# EAGLE design ultrasonic_sensor (EAGLE 6.6.0)
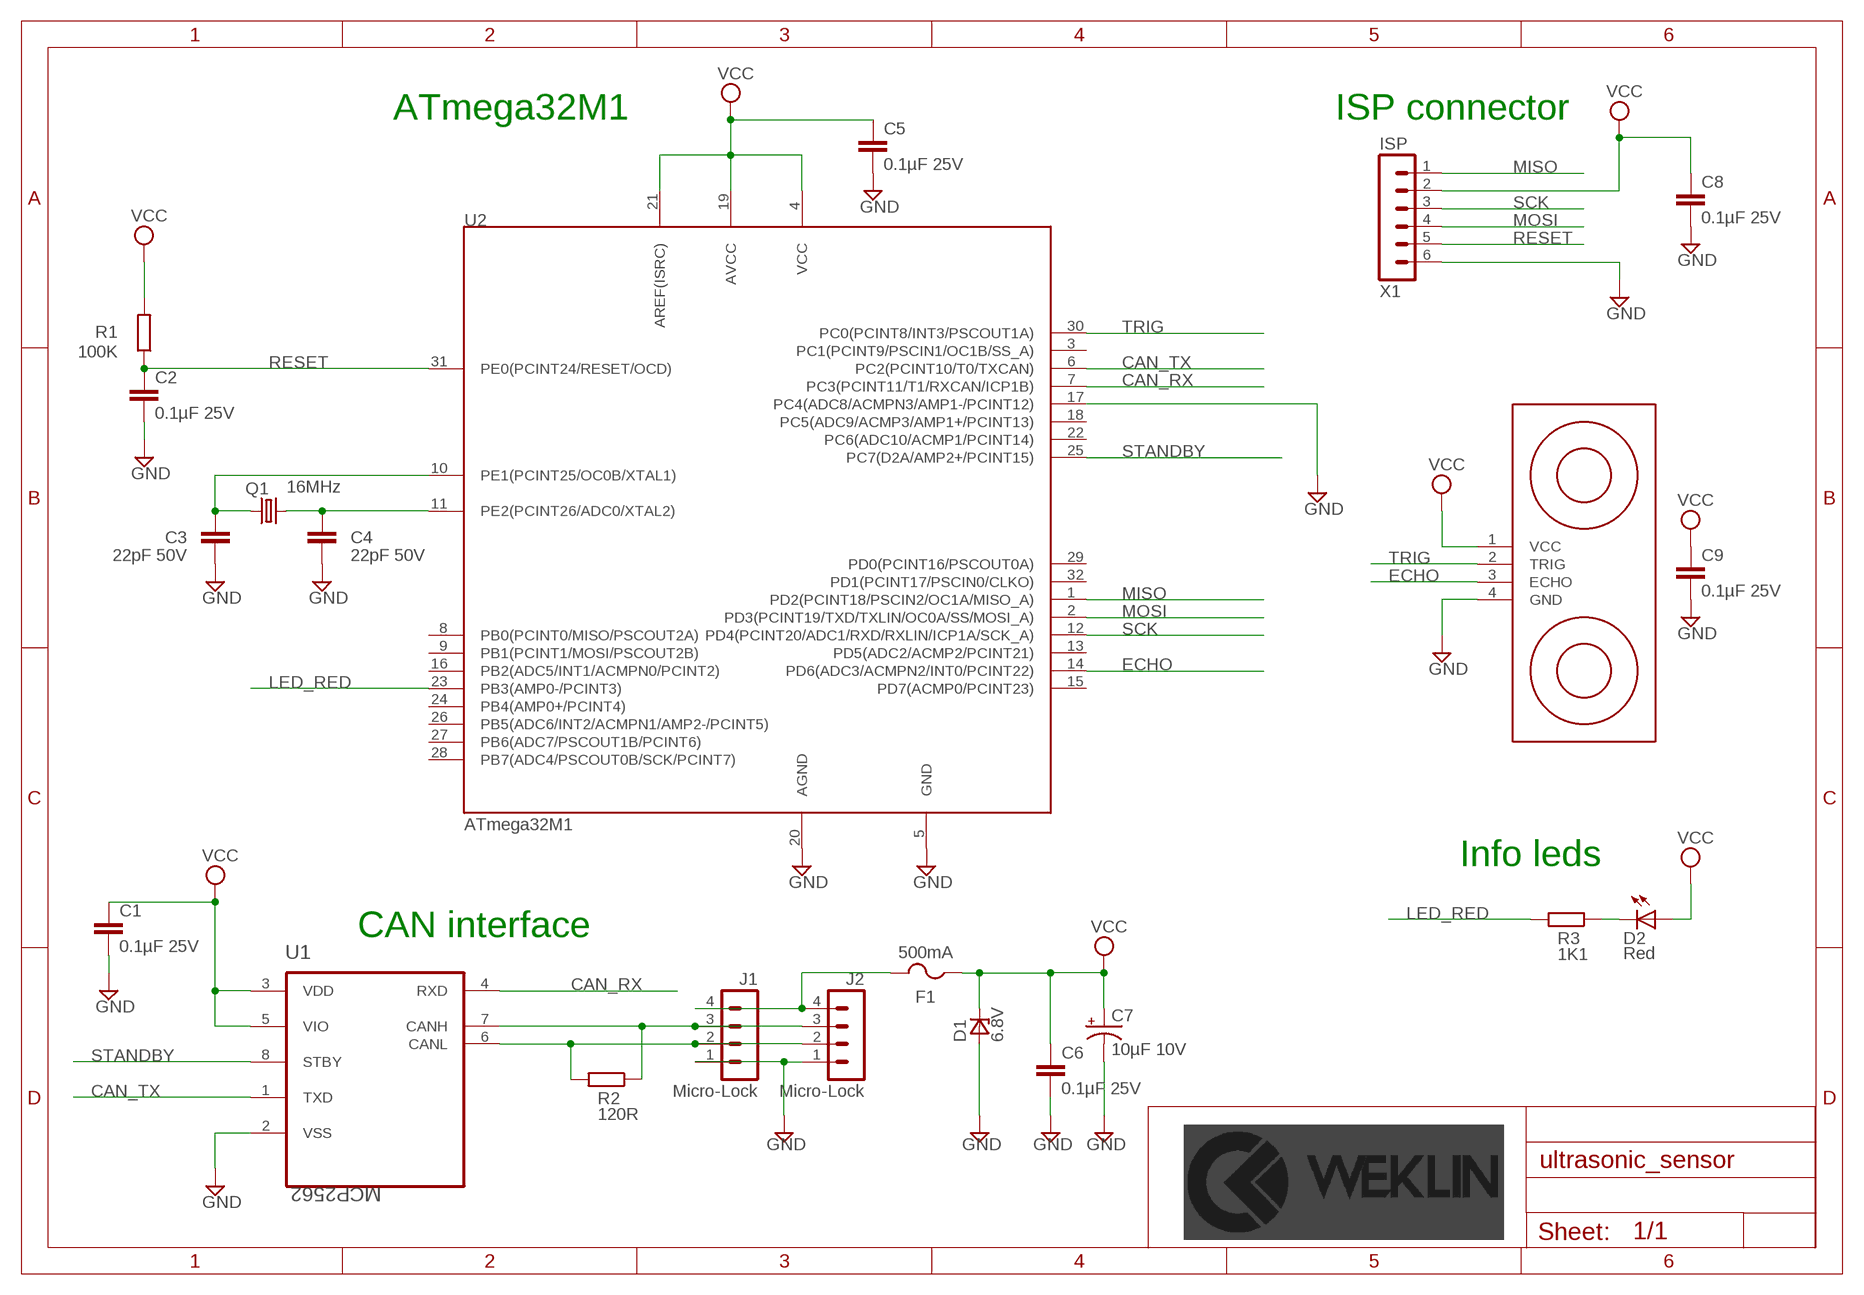
[diagram p0: schematic, sheet 1]

## Parts
C1  0.1µF 25V  CAPACITOR_NON_POL-0.1µF-25V(+-10%)(2012)  [C2012]
C2  0.1µF 25V  CAPACITOR_NON_POL-0.1µF-25V(+-10%)(2012)  [C2012]
C3  22pF 50V  CAPACITOR_NON_POL-22PF-50V(+-5%)(2012)  [C2012]
C4  22pF 50V  CAPACITOR_NON_POL-22PF-50V(+-5%)(2012)  [C2012]
C5  0.1µF 25V  CAPACITOR_NON_POL-0.1µF-25V(+-10%)(2012)  [C2012]
C6  0.1µF 25V  CAPACITOR_NON_POL-0.1µF-25V(+-10%)(2012)  [C2012]
C7  10µF 10V  CAPACITOR_POL-10µF-10V(+-10%)(3216)  [EIA3216]
C8  0.1µF 25V  CAPACITOR_NON_POL-0.1µF-25V(+-10%)(2012)  [C2012]
C9  0.1µF 25V  CAPACITOR_NON_POL-0.1µF-25V(+-10%)(2012)  [C2012]
D1  6.8V  ZENER_UNIDIR6.8  [DO-214AA]
D2  Red  LEDVLDS1235G  [VLD]
F1  500mA  FUSE  [EIARS-481-2]
J1  Micro-Lock  MICROLOCK-4CMS  [504195-0470]
J2  Micro-Lock  MICROLOCK-4CMS  [504195-0470]
Q1  16MHz  CRYSTAL-16MHZ_SMD(3225)  [SMD_KX7]
R1  100K  RESISTOR-100K(+-1%)(2012)  [R2012]
R2  120R  RESISTOR-120R(+-1%)(2012)  [R2012]
R3  1K1  RESISTOR-1K1(+-1%)(2012)  [R2012]
U1  MCP2562  MCP2562-E/SN-SOIC8  [SOIC8]
U2  ATmega32M1  ATMEGA32M1-TQFP32  [TQFP32]
U3  HC-SR04  ULTRASONIC-HC-SR04  [ULTRASONIC-HC-SR04]
X1  ISP  MINITEK_127_6WAYS-SMD  [MINITEK_127_6WAY_SMD]

## Nets
CAN_RX: U1.4(RXD) U2.7(PC3(PCINT11/T1/RXCAN/ICP1B))
CAN_TX: U1.1(TXD) U2.6(PC2(PCINT10/T0/TXCAN))
ECHO: U2.14(PD6(ADC3/ACMPN2/INT0/PCINT22)) U3.3(ECHO)
GND: C1.2 C2.2 C3.2 C4.2 C5.2 C6.2 C7.C(-) C8.2 C9.2 D1.A J1.1 J2.1 U1.2(VSS) U2.5(GND) U2.17(PC4(ADC8/ACMPN3/AMP1-/PCINT12)) U2.20(AGND) U3.4(GND) X1.6
LED_RED: R3.2 U2.23(PB3(AMP0-/PCINT3))
MISO: U2.1(PD2(PCINT18/PSCIN2/OC1A/MISO_A)) X1.1
MOSI: U2.2(PD3(PCINT19/TXD/TXLIN/OC0A/SS/MOSI_A)) X1.4
N$2: D2.C R3.1
N$4: F1.2 J1.4 J2.4
N$5: J1.2 J2.2 R2.2 U1.6(CANL)
N$6: J1.3 J2.3 R2.1 U1.7(CANH)
N$7: C4.1 Q1.3 U2.11(PE2(PCINT26/ADC0/XTAL2))
N$9: C3.1 Q1.1 U2.10(PE1(PCINT25/OC0B/XTAL1))
RESET: C2.1 R1.1 U2.31(PE0(PCINT24/RESET/OCD)) X1.5
SCK: U2.12(PD4(PCINT20/ADC1/RXD/RXLIN/ICP1A/SCK_A)) X1.3
STANDBY: U1.8(STBY) U2.25(PC7(D2A/AMP2+/PCINT15))
TRIG: U2.30(PC0(PCINT8/INT3/PSCOUT1A)) U3.2(TRIG)
VCC: C1.1 C5.1 C6.1 C7.A(+) C8.1 C9.1 D1.C D2.A F1.1 R1.2 U1.3(VDD) U1.5(VIO) U2.4(VCC) U2.19(AVCC) U2.21(AREF(ISRC)) U3.1(VCC) X1.2
Unconnected: U2.3(PC1(PCINT9/PSCIN1/OC1B/SS_A)) U2.8(PB0(PCINT0/MISO/PSCOUT2A)) U2.9(PB1(PCINT1/MOSI/PSCOUT2B)) U2.13(PD5(ADC2/ACMP2/PCINT21)) U2.15(PD7(ACMP0/PCINT23)) U2.16(PB2(ADC5/INT1/ACMPN0/PCINT2)) U2.18(PC5(ADC9/ACMP3/AMP1+/PCINT13)) U2.22(PC6(ADC10/ACMP1/PCINT14)) U2.24(PB4(AMP0+/PCINT4)) U2.26(PB5(ADC6/INT2/ACMPN1/AMP2-/PCINT5)) U2.27(PB6(ADC7/PSCOUT1B/PCINT6)) U2.28(PB7(ADC4/PSCOUT0B/SCK/PCINT7)) U2.29(PD0(PCINT16/PSCOUT0A)) U2.32(PD1(PCINT17/PSCIN0/CLKO))

## Notes on the sheet
- ATmega32M1 | ISP connector
- Info leds
- CAN interface

## Library data of the parts
C1 C2 C5 C6 C8 C9 = weklin_capacitor:CAPACITOR_NON_POL: Condensateur céramique multicouche; LIB: weklin_capacitor; MANUFACTURER: AVX; MPN: 08053C104KAT2A; OC_FARNELL: 2280951; PRICE: 0,0036
C3 C4 = weklin_capacitor:CAPACITOR_NON_POL: Condensateur céramique multicouche; LIB: weklin_capacitor; MANUFACTURER: Multicomp; MPN: MC0805N220J500CT; OC_FARNELL: 2310684; PRICE: 0,0078
C7 = weklin_capacitor:CAPACITOR_POL: Capacitor; LIB: weklin_capacitor; MANUFACTURER: Kemet; MPN: T491A106K010AT; OC_FARNELL: 2250086; PRICE: 0,0578
D1 = weklin_diode:ZENER_UNIDIR: P6SMBxxA Series of unidirectional Transient Voltage Suppressor Diodes xx = Stand-off Voltage VR in Volts; PPmax = 600 W Case: SMB = DO 214 AA Note: Footprint acc. to ST specs; source: www.st.com Author: Dipl.-Ing. FH Rainer Bayer, www.ing-rb.de/hhn Feedback: rainer.bayer@hs-heilbronn.de; LIB: weklin_diode; MANUFACTURER: ON Semiconductor; MPN: P6SMB6.8AT3G; OC_FARNELL: 1459166RL; PRICE: 0,178
D2 = weklin_led:LED: Led; LIB: weklin_led; MANUFACTURER: Vishay; MPN: VLDS1235G; OC_FARNELL: 2494682; PRICE: 0,003
F1 = weklin_fuse:FUSE: Fuse 500mA 125V ultra fast; LIB: weklin_fuse; MANUFACTURER: Littlefuse; MPN: 0451.500MRL; OC_FARNELL: 2383271; PRICE: 0,527
J1 J2 = weklin_micro-lock:MICROLOCK-4: Connecteur MOLEX de 4 Contacts Série Mini50 GEII/IUT ANGERS; LIB: weklin_micro-lock; MANUFACTURER: Molex; MPN: 504195-0470; OC_FARNELL: 2445490; PRICE: 0,713
Q1 = weklin_crystal:CRYSTAL: Crystal resonator; LIB: weklin_crystal; MANUFACTURER: AEL CRYSTALS; MPN: E3SB16.0000F09G11AE; OC_FARNELL: 2467444RL; PRICE: 0,315
R1 = weklin_resistor:RESISTOR: Resistor; LIB: weklin_resistor; MANUFACTURER: Multicomp; MPN: MCWR08X1003FTL; OC_FARNELL: 2446868; PRICE: 0,0014
R2 = weklin_resistor:RESISTOR: Resistor; LIB: weklin_resistor; MANUFACTURER: Multicomp; MPN: MCWR08X1200FTL; OC_FARNELL: 2446878; PRICE: 0,0014
R3 = weklin_resistor:RESISTOR: Resistor; LIB: weklin_resistor; MANUFACTURER: Multicomp; MPN: MC0805S8F1101T5E; OC_FARNELL: 1635316; PRICE: 0,003
U1 = weklin_ic_can:MCP2562-E/SN: High-Speed CAN Transceiver; LIB: weklin_ic_can; MANUFACTURER: Microchip; MPN: MCP2562-E/SN; OC_FARNELL: 2362839; PRICE: 1,12
U2 = weklin_micro-atmell:ATMEGA32M1: ATMEL ATMEGA32M1-AU MCU 8 BITS ATMEGA 16MHZ; LIB: weklin_micro_atmell; MANUFACTURER: Atmel; MPN: ATmega32M1-AU; OC_FARNELL: 2443180; PRICE: 6,18
U3 = weklin_ultrasonic:ULTRASONIC-HC-SR04: Ultrasonic Ranging Module HC-SR04; LIB: weklin_ultrasonic; MANUFACTURER: Unknow; MPN: HC-SR04; OC_FARNELL: N.A.; PRICE: 1,51
X1 = weklin_connector:MINITEK_127_6WAYS: Board-To-Board Connector, Micro-MaTch Series, Embase, 6voies.; LIB: weklin_connector; MANUFACTURER: Minitek; MPN: 20021121-00006C4LF; OC_FARNELL: 1865277; PRICE: 0,333

## Board
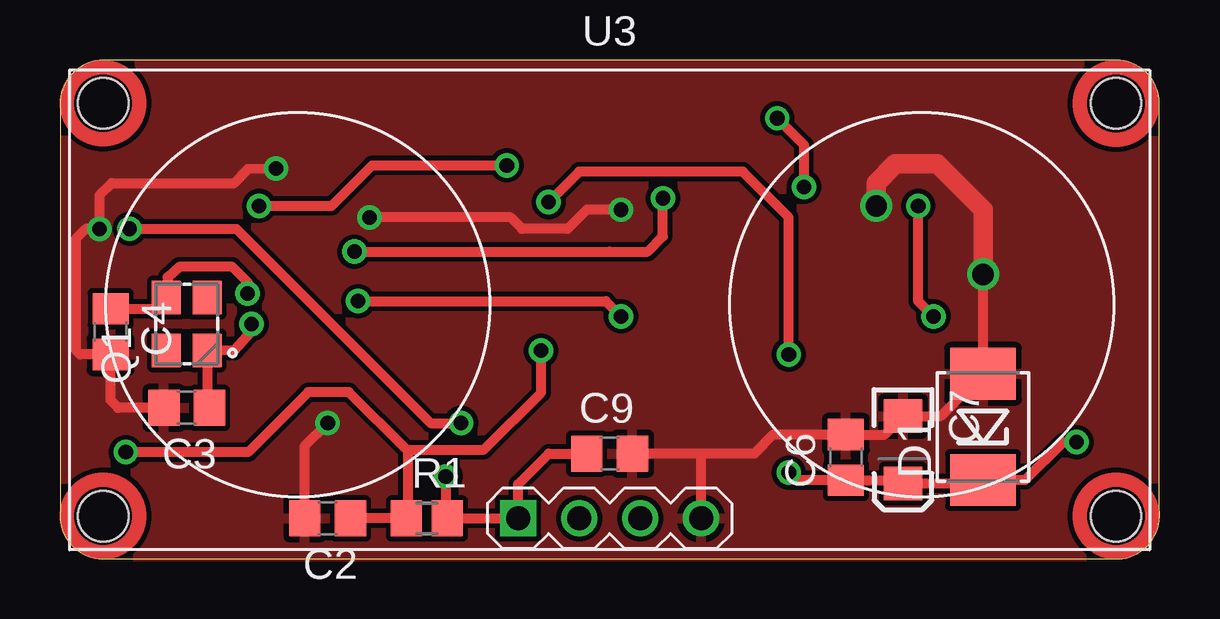
[diagram p1: board, top side]
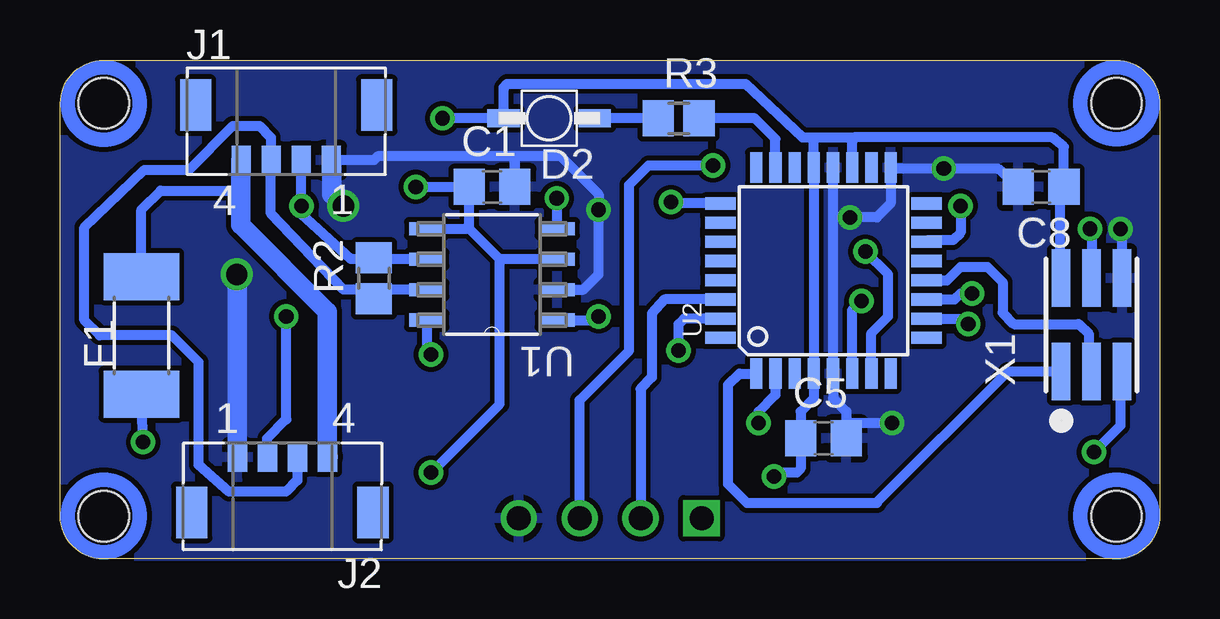
[diagram p2: board, bottom side, seen from below]

Size 45.82 x 20.78 mm. Coordinates in mm from the lower left corner, seen from the top.
Outline: 0,19.07 0,1.81 arc90 1.79,0 44.26,0 arc90 45.8,2.09 45.8,18.99 arc90 44.02,20.78 1.99,20.78 arc90 0,19.07
Copper layers (1*16): Top 0.035mm / dielectric 1.5mm / Bottom 0.035mm
Design rules "default *": minimum track width 10mil, minimum drill 24mil, track to track 8mil, track to pad 8mil, pad to pad 8mil, via to via 8mil, smd to smd 8mil, copper to edge 0mil, drill to drill 8mil, minimum pad ring 10mil, minimum via ring 8mil, stop-mask expansion 4mil, vias tented up to drill 0mil, thermal gap 10mil

### Footprints (pad centres in the part's own frame; a part is rotated, then mirrored left to right if it is on the bottom)
C2012 = smd 1.3 x 1.5: 1 -0.95,0; 2 0.95,0
EIA3216 = smd 1.4 x 1.6: A 1.4,0; C -1.4,0
DO-214AA = smd 2.159 x 2.743: A 2.21,0; C -2.21,0
VLD = smd 0.75 x 1.35: A 0,1.9; C 0,-1.9
EIARS-481-2 = smd 1.956 x 3.15: 1 -2.451,0; 2 2.451,0
504195-0470 = smd 0.8 x 1.2: 1 1.875,0; 2 0.625,0; 3 -0.625,0; 4 -1.875,0 | smd 1.3 x 2.15: P$5 -3.775,2.295; P$6 3.775,2.295
SMD_KX7 = smd 1.4 x 1.2: 1 -1.1,-0.85; 2 1.1,-0.85; 3 1.1,0.85; 4 -1.1,0.85
R2012 = smd 1.3 x 1.5: 1 -0.85,0; 2 0.85,0
SOIC8 = smd 1.473 x 0.559: 1 -2.718,1.905; 2 -2.718,0.635; 3 -2.718,-0.635; 4 -2.718,-1.905; 5 2.718,-1.905; 6 2.718,-0.635; 7 2.718,0.635; 8 2.718,1.905
TQFP32 = smd 1.27 x 0.508: 1 -4.293,2.8; 2 -4.293,2; 3 -4.293,1.2; 4 -4.293,0.4; 5 -4.293,-0.4; 6 -4.293,-1.2; 7 -4.293,-2; 8 -4.293,-2.8; 17 4.293,-2.8; 18 4.293,-2; 19 4.293,-1.2; 20 4.293,-0.4; 21 4.293,0.4; 22 4.293,1.2; 23 4.293,2; 24 4.293,2.8 | smd 0.508 x 1.27: 9 -2.8,-4.293; 10 -2,-4.293; 11 -1.2,-4.293; 12 -0.4,-4.293; 13 0.4,-4.293; 14 1.2,-4.293; 15 2,-4.293; 16 2.8,-4.293; 25 2.8,4.293; 26 2,4.293; 27 1.2,4.293; 28 0.4,4.293; 29 -0.4,4.293; 30 -1.2,4.293; 31 -2,4.293; 32 -2.8,4.293
ULTRASONIC-HC-SR04 = drill 1 square: 1 -3.81,-8.89 | drill 1: 2 -1.27,-8.89; 3 1.27,-8.89; 4 3.81,-8.89 | hole 2.1: -21.1,8.4; -21.1,-8.8; 21.1,-8.8; 21.1,8.4
MINITEK_127_6WAY_SMD = smd 0.76 x 2.4: 1 -1.27,-1.95; 2 -1.27,1.95; 3 0,-1.95; 4 0,1.95; 5 1.27,-1.95; 6 1.27,1.95

### Placement (x,y rotation side)
C1  27.82,15.5 0 bottom
C2  11.15,1.69 180 top
C3  5.28,6.29 180 top
C4  2.1,9.47 270 top
C5  14.01,5.02 0 bottom
C6  32.74,4.23 90 top
C7  35.12,4.54 270 top
C8  4.94,15.5 180 bottom
C9  22.9,4.39 0 top
D1  38.46,5.5 90 top
D2  25.44,18.36 90 bottom
DRILEGEND  [DRILEGEND]  -5.4,-6.36 0 top  (outside the outline)
F1  42.43,9.31 90 bottom
J1  36.39,16.61 0 bottom
J2  36.55,4.23 180 bottom
Q1  5.28,9.78 90 top
R1  15.28,1.69 0 top
R2  32.74,11.69 90 bottom
R3  20.04,18.36 0 bottom
U1  27.82,11.85 180 bottom
U2  14.01,12.01 90 bottom
U3  22.9,10.58 0 top
X1  2.84,9.75 0 bottom

### Tracks (layer width: path | path; a pad name or v marks a point on that pad's centre or on a via)
CAN_RX  (via drill 0.61)
  Top 0.406: v12.27,12.8 22.9,12.8 24.49,12.8 25.12,13.43 v25.12,15.02
  Bottom 0.406: U2.7 12.01,9.4 11.31,10.1 11.31,11.85 v12.27,12.8 | v25.12,15.02 25.12,13.77 U1.4
CAN_TX  (via drill 0.61)
  Top 0.406: v12.42,10.74 22.74,10.74 23.06,10.42 v23.38,10.1
  Bottom 0.406: U2.6 12.81,10.35 v12.42,10.74 | U1.1 23.54,9.94 v23.38,10.1
ECHO  (via drill 0.61)
  Top 0.406: v8.3,14.7 11.31,14.7 13,16.39 v18.62,16.39
  Bottom 0.406: U3.3 24.17,6.61 22.11,8.67 22.11,15.58 21.3,16.39 v18.62,16.39 | v8.3,14.7 8.3,13.59 8.61,13.28 9.65,13.28 U2.14
GND  (via drill 0.61, 0.89)
  Top 0.406: v38.46,11.85 D1.A 36.7,5.95 C7.C 34.36,5.18 C6.2 29.73,5.18 28.93,4.39 26.71,4.39 | C3.2 2.42,6.29 2.11,6.61 C4.2 0.83,8.52 0.68,8.67 0.68,13.35 1.08,13.75 v1.64,13.75 1.64,15.15 2.15,15.66 7.25,15.66 7.84,16.25 v9,16.26 | C2.2 10.2,4.71 v11.15,5.66 | U3.4 26.71,4.39 | 26.71,4.39 C9.2 | v23.38,14.55 21.95,14.55 21.16,13.75 19.25,13.75 18.77,14.23 v12.9,14.23
  Top 0.813: v38.46,11.85 38.46,14.55 36.55,16.45 34.81,16.45 34.01,15.66 v34.01,14.7
  Bottom 0.406: U1.2 24.01,11.21 23.38,11.85 v23.38,14.55 23.38,15.18 24.97,16.77 26.87,16.77 | 26.87,16.77 C1.2 26.87,16.45 26.87,16.77 | 26.87,16.77 32.59,16.77 32.74,16.61 J1.1 | 13.61,14.23 U2.5 13.61,6.68 13.06,6.13 13.06,5.66 | 13.61,14.23 U2.20 | 13.06,5.66 C5.2 | C8.2 6.76,16.26 v9,16.26 10.93,16.26 11.26,16.29 U2.17 11.21,14.81 11.79,14.23 v12.9,14.23 13.61,14.23 | v11.15,5.66 13.06,5.66 | 1.63,13.64 v1.64,13.75 1.57,13.68 X1.6
  Bottom 0.813: J2.1 38.43,11.5 v38.46,11.85 | v34.01,14.7 34.49,15.18 34.49,16.58 J1.1
  pour Bottom: 0.2,20.58 0.2,0.1 45.6,0.1 45.6,20.58
  pour Top: 0.2,20.58 0.2,0.1 45.6,0.1 45.6,20.58
LED_RED
  Bottom 0.406: U2.23 16.01,17.5 16.87,18.36 R3.2
MISO
  Bottom 0.406: U2.1 17.5,7.72 17.98,7.24 17.98,3.12 17.19,2.32 11.79,2.32 11.79,2.35 6.34,7.8 X1.1
MOSI  (via drill 0.61)
  Top 0.406: v2.9,13.75 7.34,13.75 15.44,5.66 v16.71,5.66
  Bottom 0.406: v16.71,5.66 16.71,6.13 16.01,6.83 U2.2 | v2.9,13.75 2.84,13.75 X1.4
N$2
  Bottom 0.406: R3.1 D2.C
N$4
  Bottom 0.406: F1.2 42.43,14.55 41.63,15.34 38.46,15.34 38.3,13.91
  Bottom 0.813: J1.4 38.3,16.61 38.3,13.91 34.68,10.29 J2.4 34.65,4.26
N$5  (via drill 0.61)
  Top 0.406: v36.4,10.1 35.76,10.74 v35.76,14.7
  Bottom 0.406: J1.2 v35.76,14.7 35.76,14.39 33.7,12.48 33.22,12.48 | J2.2 37.19,5.02 36.41,5.8 36.39,5.8 v36.4,10.1 | U1.6 33.22,12.48 | R2.2 33.16,12.54 33.22,12.48
N$6
  Bottom 0.406: J2.3 35.93,3.26 36.4,2.8 38.78,2.8 40.05,3.91 40.05,8.2 41.16,9.31 44.17,9.31 44.81,9.94 44.81,13.81 42.3,16.21 40.45,16.21 38.62,18.04 37.51,18.04 37.03,17.56 37.03,16.62 J1.3 37.03,14.39 34.01,11.21 33.22,11.21 | U1.7 33.22,11.21 | R2.1 32.85,10.84 33.22,11.21
N$7  (via drill 0.61)
  Top 0.406: v7.82,11.05 7.82,11.53 7.19,12.17 4.96,12.17 4.49,11.73 Q1.3 3.96,10.42 C4.1
  Bottom 0.406: U2.11 8.54,10.81 8.3,11.05 v7.82,11.05
N$9  (via drill 0.61)
  Top 0.406: v7.98,9.78 7.98,9.47 7.25,8.67 Q1.1 6.13,6.67 C3.1
  Bottom 0.406: U2.10 8.2,10.01 v7.98,9.78
RESET  (via drill 0.61)
  Top 0.406: 14.49,4.54 17.66,4.54 20.04,6.93 v20.04,8.67 | 14.49,4.54 14.49,1.74 R1.1 C2.1 | 14.49,4.54 14.44,4.54 12.04,6.95 10.34,6.95 7.84,4.45 v2.74,4.45
  Bottom 0.406: v20.04,8.67 20.04,9.78 19.82,10.01 U2.31 | v2.74,4.45 1.64,5.55 1.64,7.8 X1.5
SCK
  Bottom 0.406: U2.12 8.86,11.61 8.3,12.17 7.19,12.17 6.55,11.53 6.55,10.26 6.07,9.78 3.38,9.78 2.94,9.35 2.94,7.8 X1.3
STANDBY  (via drill 0.61)
  Top 0.406: v30.36,8.51 30.36,14.23 28.46,16.13 21.63,16.13 v20.36,14.86
  Bottom 0.406: U1.8 30.54,8.69 v30.36,8.51 | U2.25 20.3,14.81 v20.36,14.86
TRIG
  Bottom 0.406: U2.30 20.63,10.81 21.16,10.22 21.16,7.56 21.63,7.09 U3.2
VCC  (via drill 0.61)
  Top 0.406: v42.36,4.86 41.79,4.86 40.22,3.29 D1.C 38.32,3.15 C7.A 34.99,3.28 C6.1 30.68,3.28 v30.36,3.59 | C9.1 20.36,4.39 19.09,3.12 U3.1 R1.2 16.08,1.74 v16.08,3.43 | v29.89,18.36 31,17.25 v31,15.5
  Bottom 0.406: v42.36,4.86 F1.1 | U1.3 27.51,12.48 | 27.51,12.48 28.78,13.75 28.78,13.91 | 28.78,13.91 C1.1 v31,15.5 | U1.5 28.93,13.75 28.78,13.91 | v30.36,3.59 27.51,6.45 27.51,12.48 | 14.44,17.56 14.89,17.56 17.27,19.78 27.19,19.78 27.34,19.63 D2.A v29.89,18.36 | 14.44,17.56 12.74,17.56 | U2.19 12.81,17.32 12.74,17.56 | 12.74,17.56 4.49,17.56 3.99,17.17 C8.1 | v16.08,3.43 15.92,3.59 15.12,3.59 14.96,3.75 C5.1 14.96,6.13 14.41,6.68 U2.4 U2.21 14.41,17.53 14.44,17.56 | 4.17,15.32 C8.1 | X1.2 4.14,11.7 4.14,14.95 3.99,14.95 C8.1
(copper drawn outside any net)
  shapes: Bottom circle x4, Top circle x4

### Text on the board
DrillLegend: LAYER-STACK
DrillLegend_01-16: 01-16
DrillLegend_01-20: 01-20